# Altium project FLXESC.PrjPcb
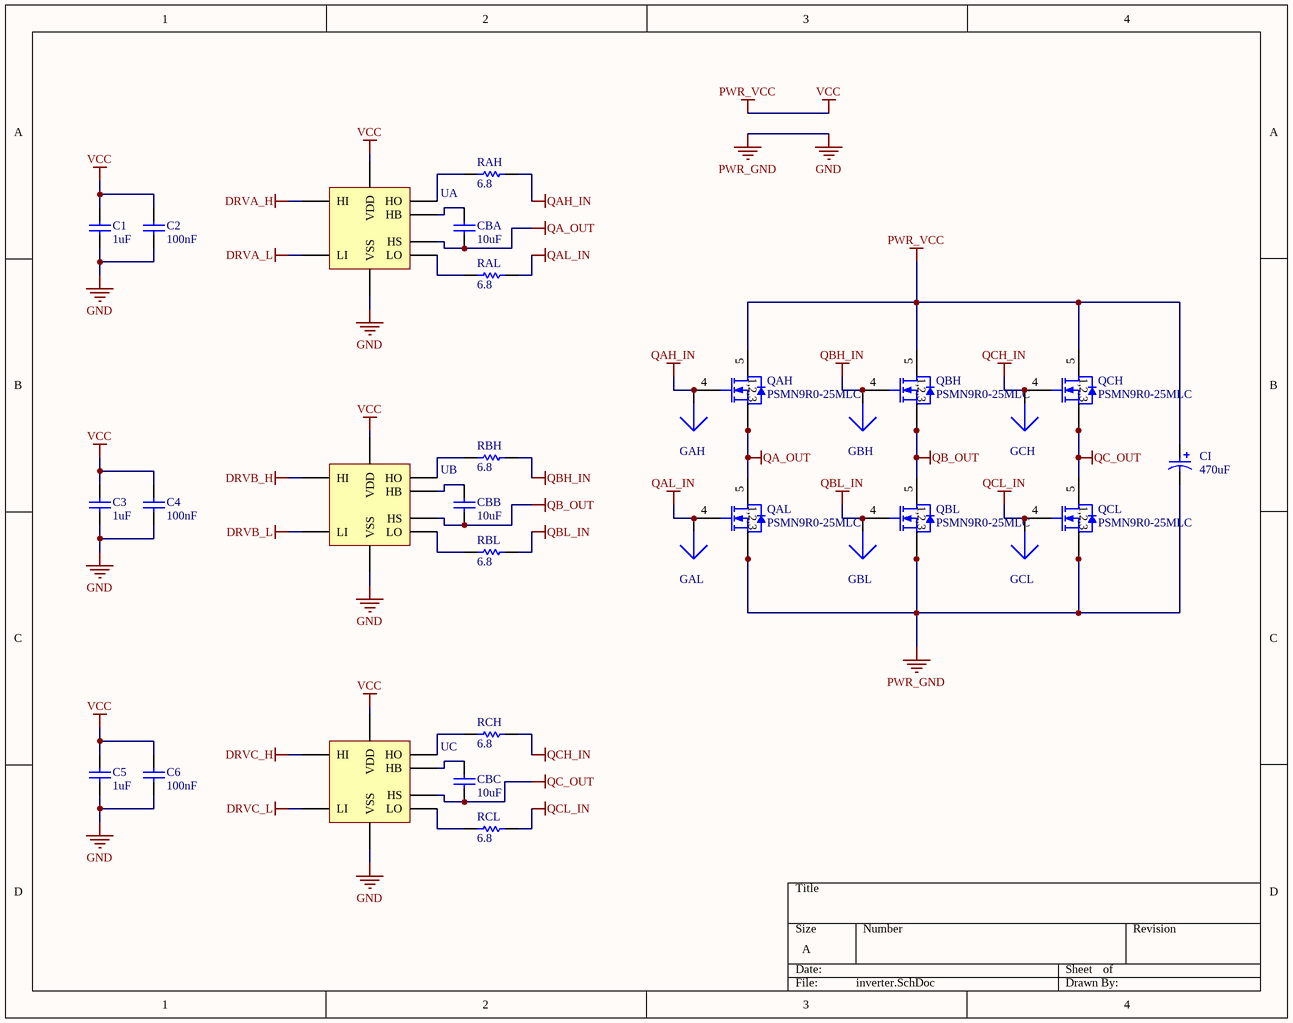
[diagram p0: inverter.SchDoc]
4 sheets, 87 parts. Net scope: global (net labels, ports and power ports of the same name join across sheets).
Board file: ESC.PcbDoc
Sheets:
  inverter.SchDoc
  connectors.SchDoc
  microcontroller.SchDoc
  phase_sense.SchDoc

## Sheet inverter.SchDoc
size A

### Parts
C1  1uF  [CAPC1608L]
C2  100nF  [CAPC1608L]
C3  1uF  [CAPC1608L]
C4  100nF  [CAPC1608L]
C5  1uF  [CAPC1608L]
C6  100nF  [CAPC1608L]
CBA  10uF  [CAPC3216L]
CBB  10uF  [CAPC3216L]
CBC  10uF  [CAPC3216L]
CI  470uF  [CAP_RADIAL-CAN_SMD_M10]
GAH  TESTPOINT-ARROW-BLUE  [TESTP_PAD_.75mm]  (value not drawn)
GAL  TESTPOINT-ARROW-BLUE  [TESTP_PAD_.75mm]  (value not drawn)
GBH  TESTPOINT-ARROW-BLUE  [TESTP_PAD_.75mm]  (value not drawn)
GBL  TESTPOINT-ARROW-BLUE  [TESTP_PAD_.75mm]  (value not drawn)
GCH  TESTPOINT-ARROW-BLUE  [TESTP_PAD_.75mm]  (value not drawn)
GCL  TESTPOINT-ARROW-BLUE  [TESTP_PAD_.75mm]  (value not drawn)
QAH  value PSMN9R0-25MLC  [x-NXP_LFPAK33]
QAL  value PSMN9R0-25MLC  [x-NXP_LFPAK33]
QBH  value PSMN9R0-25MLC  [x-NXP_LFPAK33]
QBL  value PSMN9R0-25MLC  [x-NXP_LFPAK33]
QCH  value PSMN9R0-25MLC  [x-NXP_LFPAK33]
QCL  value PSMN9R0-25MLC  [x-NXP_LFPAK33]
RAH  6.8  [RESC1608L]
RAL  6.8  [RESC1608L]
RBH  6.8  [RESC1608L]
RBL  6.8  [RESC1608L]
RCH  6.8  [RESC1608L]
RCL  6.8  [RESC1608L]
UA  UCC27201A  [x-TI_S-PVSON-N9]  (value not drawn)
UB  UCC27201A  [x-TI_S-PVSON-N9]  (value not drawn)
UC  UCC27201A  [x-TI_S-PVSON-N9]  (value not drawn)

### Nets
DRVA_H: UA.6(HI)
DRVA_L: UA.7(LI)
DRVB_H: UB.6(HI)
DRVB_L: UB.7(LI)
DRVC_H: UC.6(HI)
DRVC_L: UC.7(LI)
GND: C1.2 C2.2 C3.2 C4.2 C5.2 C6.2 CI.2 QAL.1(S) QAL.2(S) QAL.3(S) QBL.1(S) QBL.2(S) QBL.3(S) QCL.1(S) QCL.2(S) QCL.3(S) UA.8(VSS) UB.8(VSS) UC.8(VSS)  [also labelled PWR_GND]
PWR_VCC: C1.1 C2.1 C3.1 C4.1 C5.1 C6.1 CI.1 QAH.5(D) QBH.5(D) QCH.5(D) UA.1(VDD) UB.1(VDD) UC.1(VDD)  [also labelled VCC]
QA_OUT: CBA.2 QAH.1(S) QAH.2(S) QAH.3(S) QAL.5(D) UA.4(HS)
QAH_IN: GAH.1 QAH.4(G) RAH.1
QAL_IN: GAL.1 QAL.4(G) RAL.1
QB_OUT: CBB.2 QBH.1(S) QBH.2(S) QBH.3(S) QBL.5(D) UB.4(HS)
QBH_IN: GBH.1 QBH.4(G) RBH.1
QBL_IN: GBL.1 QBL.4(G) RBL.1
QC_OUT: CBC.2 QCH.1(S) QCH.2(S) QCH.3(S) QCL.5(D) UC.4(HS)
QCH_IN: GCH.1 QCH.4(G) RCH.1
QCL_IN: GCL.1 QCL.4(G) RCL.1
NetCBA_1: CBA.1 UA.2(HB)
NetCBB_1: CBB.1 UB.2(HB)
NetCBC_1: CBC.1 UC.2(HB)
NetRAH_2: RAH.2 UA.3(HO)
NetRAL_2: RAL.2 UA.9(LO)
NetRBH_2: RBH.2 UB.3(HO)
NetRBL_2: RBL.2 UB.9(LO)
NetRCH_2: RCH.2 UC.3(HO)
NetRCL_2: RCL.2 UC.9(LO)

### Notes on the sheet
- (in symbol PSMN9R0-25MLC) 1,2,3

### Library data of the parts
C1 C3 C5 = CAP_1u_0603_25V_X5R_10%: CAP CER 1UF 25V 10% X5R 0603; Manufacturer Part Number: TMK107BJ105KA-T; Name: CAP_1u_0603_25V_X5R_10%; Value: 1uF; Supplier 1: Digi-Key; Supplier Part Number 1: 587-1248-1-ND
C2 C4 C6 = CAP_100n_0603_50V_Y5V: CAP CER 0.1UF 50V Y5V 0603; Manufacturer Part Number: CC0603ZRY5V9BB104; Name: CAP_100n_0603_50V_Y5V; Value: 100nF; Supplier 1: Digi-Key; Supplier Part Number 1: 311-1343-1-ND
CBA CBB CBC = CAP_10u_1206_25V_Y5V: CAP CER 10UF 25V Y5V 1206; Manufacturer Part Number: TMK316F106ZL-T; Name: CAP_10u_1206_25V_Y5V; Value: 10uF; Supplier 1: Digi-Key; Supplier Part Number 1: 587-1353-1-ND
CI = CAP_E_470u_Dia10_25V_Al_20%: CAP ALUM 470UF 25V 20% SMD; Manufacturer: Nichicon; Manufacturer Part Number: UCW1E471MNL1GS; Name: CAP_E_470u_Dia10_25V_Al_20%; Value: 470uF; Supplier 1: Digi-Key; Supplier Part Number 1: 493-9424-1-ND
GAH GAL GBH GBL GCH GCL = TESTP_PAD_.75mm: Round Test Point on Board; Value: 0.75mm; Name: TESTP_PAD_.75mm
QAH QAL QBH QBL QCH QCL = PSMN9R0-25MLC: TRANSISTOR MOSFET N-CHANN 25V 8.6MOHM; Manufacturer: NXP Semiconductors; Manufacturer Part Number: PSMN9R0-25MLC,115; Name: PSMN9R0-25MLC; Supplier 1: Digi-Key; Supplier Part Number 1: 568-9578-1-ND
RAH RAL RBH RBL RCH RCL = RES_6R8_0603_0W1_1%: RES 6.8 OHM 1/10W 1% 0603; Manufacturer: Stackpole Electronics Inc; Manufacturer Part Number: RMCF0603FT6R80; Name: RES_6R8_0603_0W1_1%; Value: 6.8; Supplier 1: Digi-Key; Supplier Part Number 1: RMCF0603FT6R80CT-ND
UA UB UC = x-TI_UCC27201A: IC DVR HIGH/LOW SIDE 3A 9SON; Manufacturer: Texas Instruments; Manufacturer Part Number: UCC27201ADRCT; Name: x-TI_UCC27201A; Supplier 1: Digi-Key; Supplier Part Number 1: 296-30051-2-ND

## Sheet connectors.SchDoc
size A
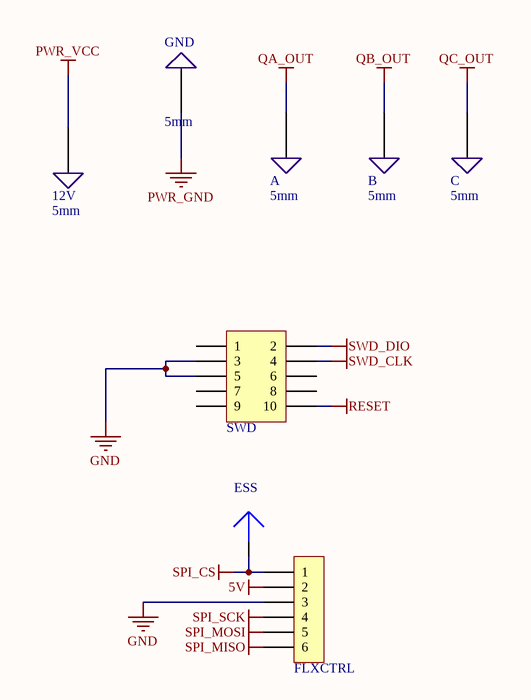
[diagram p1: connectors.SchDoc]

### Parts
12V  5mm  [SQUARE_PAD_5mm]  (no BOM)
A  5mm  [SQUARE_PAD_5mm]  (no BOM)
B  5mm  [SQUARE_PAD_5mm]  (no BOM)
C  5mm  [SQUARE_PAD_5mm]  (no BOM)
ESS  TESTPOINT-ARROW-BLUE  [TESTP_PAD_.75mm]  (value not drawn)
FLXCTRL  HEADER-6x1  [X-JST-S6B-ZR]  (value not drawn)
GND  5mm  [SQUARE_PAD_5mm]  (no BOM)
SWD  HEADER-5x2S  [G-HEADER_5x2I.05P_SM]  (value not drawn)

### Nets
5V: FLXCTRL.2
GND: FLXCTRL.3 GND.1(Wire) SWD.3 SWD.5  [also labelled PWR_GND]
PWR_VCC: 12V.1(Wire)
QA_OUT: A.1(Wire)
QB_OUT: B.1(Wire)
QC_OUT: C.1(Wire)
RESET: SWD.10
SPI_CS: ESS.1 FLXCTRL.1
SPI_MISO: FLXCTRL.6
SPI_MOSI: FLXCTRL.5
SPI_SCK: FLXCTRL.4
SWD_CLK: SWD.4
SWD_DIO: SWD.2

Not connected (* = marked no-connect by the designer): SWD 1 6 7 8 9

### Library data of the parts
12V A B C GND = SOLDER_WIRE_5x5: Pad to solder wire; Name: SOLDER_WIRE_5x5; Value: 5mm
ESS = TESTP_PAD_.75mm: Round Test Point on Board; Value: 0.75mm; Name: TESTP_PAD_.75mm
FLXCTRL = HEADER_6x1_1.5mm_ZH_TH: CONN HEADER ZH SIDE 6POS 1.5MM; Manufacturer: JST Sales America Inc; Manufacturer Part Number: S6B-ZR(LF)(SN); Name: HEADER_6x1_1.5mm_ZH_TH; Supplier 1: Digi-Key; Supplier Part Number 1: 455-1673-ND
SWD = HEADER_5x2_50mil_U: CONN HEADER 10POS DL UNSHRD SMD; Name: HEADER_5x2_50mil_U

## Sheet microcontroller.SchDoc
size A
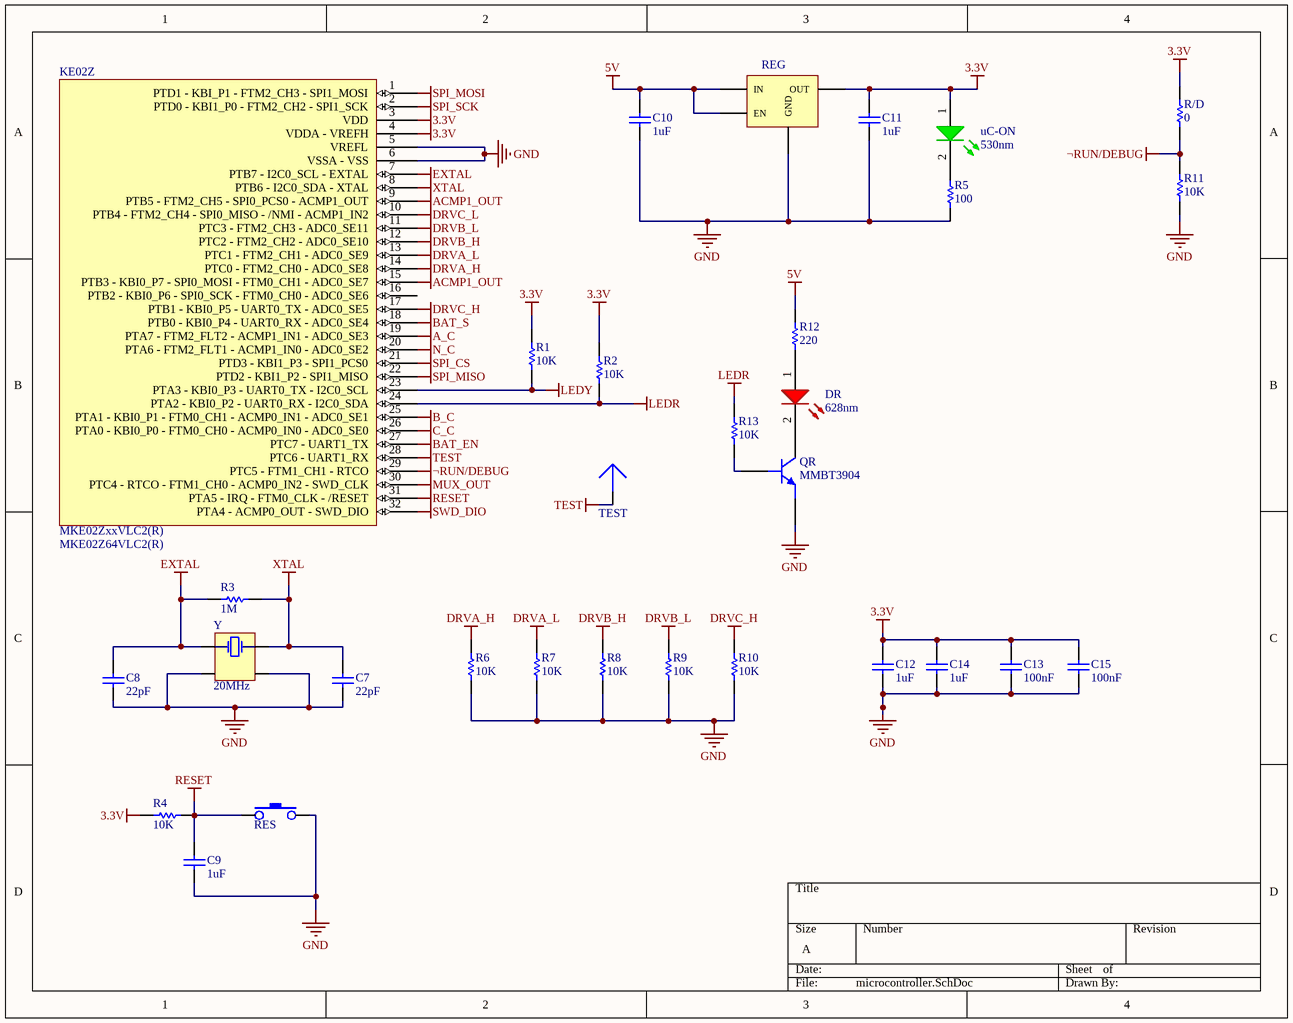
[diagram p2: microcontroller.SchDoc]

### Parts
C7  22pF  [CAPC1608L]
C8  22pF  [CAPC1608L]
C9  1uF  [CAPC1608L]
C10  1uF  [CAPC1608L]
C11  1uF  [CAPC1608L]
C12  1uF  [CAPC1608L]
C13  100nF  [CAPC1608L]
C14  1uF  [CAPC1608L]
C15  100nF  [CAPC1608L]
DR  value 628nm  [DSO-F2/D3.4]  (hidden comment: LED-RED)
KE02Z  MKE02ZxxVLC2(R)  Manufacturer Part Number: MKE02Z64VLC2(R)  [JEDEC_MS-026BBA]
QR  value MMBT3904  [SOT23-3L]  (hidden comment: BJT-NPN-BEC)
R1  10K  [RESC1608L]
R2  10K  [RESC1608L]
R3  1M  [RESC1608L]
R4  10K  [RESC1608L]
R5  100  [RESC1608L]
R6  10K  [RESC1608L]
R7  10K  [RESC1608L]
R8  10K  [RESC1608L]
R9  10K  [RESC1608L]
R10  10K  [RESC1608L]
R11  10K  [RESC1608L]
R12  220  [RESC1608L]
R13  10K  [RESC1608L]
R/D  0  [RESC1608L]
REG  LP5900  [x-TI_S-NGF0006A]  (value not drawn)
RES  SWITCH_TACTILE_SPST-2T-NO  [X-TECO_FSMSM]  (value not drawn)
TEST  TESTPOINT-ARROW-BLUE  [TESTP_PAD_.75mm]  (value not drawn)
uC-ON  value 530nm  [DSO-F2/D3.4]  (hidden comment: LED-GREEN)
Y  20MHz  [X-EPSO_TSX-3225]

### Nets
3.3V: C11.1 C12.1 C13.1 C14.1 C15.1 KE02Z.3(VDD) KE02Z.4(VDDA_-_VREFH) R1.1 R2.1 R4.1 R/D.1 REG.1(OUT) uC-ON.1(A)
5V: C10.1 R12.1 REG.4(EN) REG.6(IN)
A_C: KE02Z.19(PTA7_-_FTM2_FLT2_-_ACMP1_IN1_-_ADC0_SE3)
ACMP1_OUT: KE02Z.9(PTB5_-_FTM2_CH5_-_SPI0_PCS0_-_ACMP1_OUT) KE02Z.15(PTB3_-_KBI0_P7_-_SPI0_MOSI_-_FTM0_CH1_-_ADC0_SE7)
B_C: KE02Z.25(PTA1_-_KBI0_P1_-_FTM0_CH1_-_ACMP0_IN1_-_ADC0_SE1)
BAT_EN: KE02Z.27(PTC7_-_UART1_TX)
BAT_S: KE02Z.18(PTB0_-_KBI0_P4_-_UART0_RX_-_ADC0_SE4)
C_C: KE02Z.26(PTA0_-_KBI0_P0_-_FTM0_CH0_-_ACMP0_IN0_-_ADC0_SE0)
DRVA_H: KE02Z.14(PTC0_-_FTM2_CH0_-_ADC0_SE8) R6.1
DRVA_L: KE02Z.13(PTC1_-_FTM2_CH1_-_ADC0_SE9) R7.1
DRVB_H: KE02Z.12(PTC2_-_FTM2_CH2_-_ADC0_SE10) R8.1
DRVB_L: KE02Z.11(PTC3_-_FTM2_CH3_-_ADC0_SE11) R9.1
DRVC_H: KE02Z.17(PTB1_-_KBI0_P5_-_UART0_TX_-_ADC0_SE5) R10.1
DRVC_L: KE02Z.10(PTB4_-_FTM2_CH4_-_SPI0_MISO_-_/NMI_-_ACMP1_IN2)
EXTAL: C8.1 KE02Z.7(PTB7_-_I2C0_SCL_-_EXTAL) R3.2 Y.1
GND: C7.2 C8.2 C9.2 C10.2 C11.2 C12.2 C13.2 C14.2 C15.2 KE02Z.5(VREFL) KE02Z.6(VSSA_-_VSS) QR.2(E) R5.2 R6.2 R7.2 R8.2 R9.2 R10.2 R11.2 REG.3(GND) RES.2 Y.2 Y.4
LEDR: KE02Z.24(PTA2_-_KBI0_P2_-_UART0_RX_-_I2C0_SDA) R2.2 R13.2
LEDY: KE02Z.23(PTA3_-_KBI0_P3_-_UART0_TX_-_I2C0_SCL) R1.2
MUX_OUT: KE02Z.30(PTC4_-_RTCO_-_FTM1_CH0_-_ACMP0_IN2_-_SWD_CLK)
N_C: KE02Z.20(PTA6_-_FTM2_FLT1_-_ACMP1_IN0_-_ADC0_SE2)
RESET: C9.1 KE02Z.31(PTA5_-_IRQ_-_FTM0_CLK_-_/RESET) R4.2 RES.1
SPI_CS: KE02Z.21(PTD3_-_KBI1_P3_-_SPI1_PCS0)
SPI_MISO: KE02Z.22(PTD2_-_KBI1_P2_-_SPI1_MISO)
SPI_MOSI: KE02Z.1(PTD1_-_KBI_P1_-_FTM2_CH3_-_SPI1_MOSI)
SPI_SCK: KE02Z.2(PTD0_-_KBI1_P0_-_FTM2_CH2_-_SPI1_SCK)
SWD_DIO: KE02Z.32(PTA4_-_ACMP0_OUT_-_SWD_DIO)
TEST: KE02Z.28(PTC6_-_UART1_RX) TEST.1
XTAL: C7.1 KE02Z.8(PTB6_-_I2C0_SDA_-_XTAL) R3.1 Y.3
¬RUN/DEBUG: KE02Z.29(PTC5_-_FTM1_CH1_-_RTCO) R11.1 R/D.2
NetDR_1: DR.1(A) R12.2
NetDR_2: DR.2(K) QR.3(C)
NetQR_1: QR.1(B) R13.1
NetR5_1: R5.1 uC-ON.2(K)

Not connected (* = marked no-connect by the designer): KE02Z 16(PTB2_-_KBI0_P6_-_SPI0_SCK_-_FTM0_CH0_-_ADC0_SE6)

### Library data of the parts
C7 C8 = CAP_22p_0603_50V_NP0_5%: CAP CER 22PF 50V 5% NP0 0603; Manufacturer Part Number: CL10C220JB8NCNC; Name: CAP_22p_0603_50V_NP0_5%; Value: 22pF; Supplier 1: Digi-Key; Supplier Part Number 1: 1276-2227-1-ND
C9-C12 C14 = CAP_1u_0603_25V_X5R_10%: as C1 on sheet inverter; Name: CAP_1u_0603_25V_X5R_10%; Value: 1uF; Supplier 1: Digi-Key; Supplier Part Number 1: 587-1248-1-ND
C13 C15 = CAP_100n_0603_50V_Y5V: as C2 on sheet inverter; Name: CAP_100n_0603_50V_Y5V; Value: 100nF; Supplier 1: Digi-Key; Supplier Part Number 1: 311-1343-1-ND
DR = LED_RED_0603_628: LED POINTLED 628NM SUPER RED SMD; Manufacturer: OSRAM Opto Semiconductors Inc; Manufacturer Part Number: LS Q971-KN-1; Drawn By: Juan I Carrano; Name: LED_RED_0603_628; Supplier 1: Digi-Key; Supplier Part Number 1: 475-3016-1-ND
KE02Z = MKE02Z64VLC2(R): Kinetis KE02 Cortex®-M0+ MCU 32 Pin LQFP; Manufacturer: Freescale; Name: MKE02Z64VLC2(R)
QR = MMBT3904: TRANSISTOR NPN 40V 0.2A SOT23; Manufacturer: NXP Semiconductors; Name: MMBT3904; Manufacturer Part Number: MMBT3904; Supplier 1: Digi-Key; Supplier Part Number 1: 568-4510-1-ND
R1 R2 R4 R6-R11 R13 = RES_10K_0603_0W1_1%: RES 10K OHM 1/10W 5% 0603; Manufacturer Part Number: RC1608J103CS; Name: RES_10K_0603_0W1_1%; Value: 10K; Supplier 1: Digi-Key; Supplier Part Number 1: 1276-5086-1-ND
R3 = RES_1M_0603_0W1_1%: RES 1.00M OHM 1/10W 1% 0603 SMD; Manufacturer: Yageo; Manufacturer Part Number: RC0603FR-071ML; Name: RES_1M_0603_0W1_1%; Value: 1M; Supplier 1: Digi-Key; Supplier Part Number 1: 311-1.00MHRCT-ND
R5 = RES_100_0603_0W1_1%: RES 100 OHM 1/10W 5% 0603 SMD; Manufacturer Part Number: RC0603JR-07100RL; Name: RES_100_0603_0W1_1%; Value: 100; Supplier 1: Digi-Key; Supplier Part Number 1: 311-100GRCT-ND
R12 = RES_100_0603_0W1_1%: RES 100 OHM 1/10W 5% 0603 SMD; Manufacturer Part Number: RC0603JR-07100RL; Value: 100; Name: RES_100_0603_0W1_1%; Supplier 1: Digi-Key; Supplier Part Number 1: 311-100GRCT-ND
R/D = RES_0_0603_0W1_1%: RES 0.0 OHM 1/10W JUMP 0603; Manufacturer Part Number: RC1608J000CS; Name: RES_0_0603_0W1_1%; Value: 0; Supplier 1: Digi-Key; Supplier Part Number 1: 1276-3510-1-ND
REG = x-TI_LP5900: IC REG LDO 3.3V 0.15A 6WSON; Manufacturer: Texas Instruments; Manufacturer Part Number: LP5900SD-3.3/NOPB; Name: x-TI_LP5900; Supplier 1: Digi-Key; Supplier Part Number 1: LP5900SD-3.3/NOPBCT-ND
RES = SW_TACT_3.5x6mm_SMT: SWITCH TACTILE SPST-NO 0.05A 12V; Manufacturer: TE Connectivity; Manufacturer Part Number: FSMSM; Name: SW_TACT_3.5x6mm_SMT; Supplier 1: Digi-Key; Supplier Part Number 1: 450-1140-ND
TEST = TESTP_PAD_.75mm: Round Test Point on Board; Value: 0.75mm; Name: TESTP_PAD_.75mm
uC-ON = LED_GREEN_0603_530: LED CHIPLED 570NM GREEN 0603 SMD; Manufacturer: OSRAM Opto Semiconductors Inc; Manufacturer Part Number: LG Q971-KN-1; Drawn By: Juan I Carrano; Name: LED_GREEN_0603_530; Supplier 1: Digi-Key; Supplier Part Number 1: 475-1409-1-ND
Y = XTAL_20M_SMD_9p: CRYSTAL 20MHZ 9PF SMD; Manufacturer: EPSON; Manufacturer Part Number: TSX-3225 20.0000MF20G-AC3; Drawn By: Juan I Carrano; Name: XTAL_20M_SMD_9p; Value: 20MHz; Supplier 1: Digi-Key; Supplier Part Number 1: SER3629CT-ND

## Sheet phase_sense.SchDoc
size A
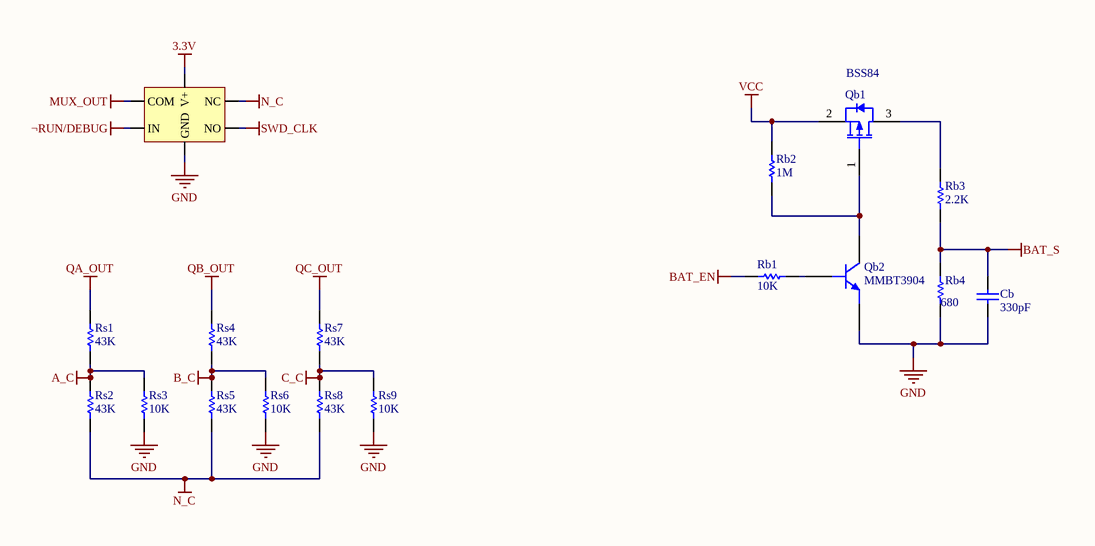
[diagram p3: phase_sense.SchDoc]

### Parts
Cb  330pF  [CAPC2012L]
MUX  TS5A3159A  [JEDEC_MO-178AB]  (value not drawn)
Qb1  BSS84  [SOT23-3L]
Qb2  value MMBT3904  [SOT23-3L]  (hidden comment: BJT-NPN-BEC)
Rb1  10K  [RESC1608L]
Rb2  1M  [RESC1608L]
Rb3  2.2K  [RESC1608L]
Rb4  680  [RESC1608L]
Rs1  43K  [RESC1608L]
Rs2  43K  [RESC1608L]
Rs3  10K  [RESC1608L]
Rs4  43K  [RESC1608L]
Rs5  43K  [RESC1608L]
Rs6  10K  [RESC1608L]
Rs7  43K  [RESC1608L]
Rs8  43K  [RESC1608L]
Rs9  10K  [RESC1608L]

### Nets
3.3V: MUX.5(V+)
A_C: Rs1.2 Rs2.1 Rs3.1
B_C: Rs4.2 Rs5.1 Rs6.1
BAT_EN: Rb1.2
BAT_S: Cb.1 Rb3.2 Rb4.1
C_C: Rs7.2 Rs8.1 Rs9.1
GND: Cb.2 MUX.2(GND) Qb2.2(E) Rb4.2 Rs3.2 Rs6.2 Rs9.2
MUX_OUT: MUX.4(COM)
N_C: MUX.3(NC) Rs2.2 Rs5.2 Rs8.2
QA_OUT: Rs1.1
QB_OUT: Rs4.1
QC_OUT: Rs7.1
SWD_CLK: MUX.1(NO)
VCC: Qb1.2(S) Rb2.1  [project net PWR_VCC]
¬RUN/DEBUG: MUX.6(IN)
NetQb1_1: Qb1.1(G) Qb2.3(C) Rb2.2
NetQb1_3: Qb1.3(D) Rb3.1
NetQb2_1: Qb2.1(B) Rb1.1

### Library data of the parts
Cb = CAP_330p_0805_100V_NP0_10%: CAP CER 330PF 100V 5% NP0 0805; Manufacturer Part Number: CL21C331JCANNNC; Name: CAP_330p_0805_100V_NP0_10%; Value: 330pF; Supplier 1: Digi-Key; Supplier Part Number 1: 1276-2646-1-ND
MUX = x-TI_TS5A3159A: IC SWITCH SPDT SOT23-6; Manufacturer: "Texas Instruments"; Manufacturer Part Number: TS5A3159ADBVR; Name: x-TI_TS5A3159A; Supplier 1: Digi-Key; Supplier Part Number 1: 296-19265-1-ND
Qb1 = BSS84: MOSFET P-CH 50V 130MA SOT-23; Manufacturer: Fairchild Semiconductor; Name: BSS84; Value: BSS84; Manufacturer Part Number: BSS84; Supplier 1: Digi-Key; Supplier Part Number 1: BSS84CT-ND
Qb2 = MMBT3904: as QR on sheet microcontroller; Name: MMBT3904; Manufacturer Part Number: MMBT3904; Supplier 1: Digi-Key; Supplier Part Number 1: 568-4510-1-ND
Rb1 Rs1-Rs9 = RES_10K_0603_0W1_1%: as R1 on sheet microcontroller; Name: RES_10K_0603_0W1_1%; Value: 10K; Supplier 1: Digi-Key; Supplier Part Number 1: 1276-5086-1-ND
Rb2 = RES_1M_0603_0W1_1%: as R3 on sheet microcontroller; Name: RES_1M_0603_0W1_1%; Value: 1M; Supplier 1: Digi-Key; Supplier Part Number 1: 311-1.00MHRCT-ND
Rb3 = RES_2K2_0603_0W1_1%: RES 2.2K OHM 1/10W 1% 0603 SMD; Manufacturer: Rohm Semiconductor; Manufacturer Part Number: MCR03ERTF2201; Name: RES_2K2_0603_0W1_1%; Value: 2.2K; Supplier 1: Digi-Key; Supplier Part Number 1: RHM2.20KCFCT-ND
Rb4 = RES_680_0603_0W1_1%: RES 680 OHM 1/10W 1% 0603 SMD; Manufacturer: Rohm Semiconductor; Manufacturer Part Number: MCR03ERTF6800; Name: RES_680_0603_0W1_1%; Value: 680; Supplier 1: Digi-Key; Supplier Part Number 1: RHM680CFCT-ND

## Nets that join several sheets
3.3V: microcontroller (13 pins), phase_sense (MUX.5)
5V: connectors (FLXCTRL.2), microcontroller (C10.1 R12.1 REG.4 REG.6)
A_C: microcontroller (KE02Z.19), phase_sense (Rs1.2 Rs2.1 Rs3.1)
B_C: microcontroller (KE02Z.25), phase_sense (Rs4.2 Rs5.1 Rs6.1)
BAT_EN: microcontroller (KE02Z.27), phase_sense (Rb1.2)
BAT_S: microcontroller (KE02Z.18), phase_sense (Cb.1 Rb3.2 Rb4.1)
C_C: microcontroller (KE02Z.26), phase_sense (Rs7.2 Rs8.1 Rs9.1)
DRVA_H: inverter (UA.6), microcontroller (KE02Z.14 R6.1)
DRVA_L: inverter (UA.7), microcontroller (KE02Z.13 R7.1)
DRVB_H: inverter (UB.6), microcontroller (KE02Z.12 R8.1)
DRVB_L: inverter (UB.7), microcontroller (KE02Z.11 R9.1)
DRVC_H: inverter (UC.6), microcontroller (KE02Z.17 R10.1)
DRVC_L: inverter (UC.7), microcontroller (KE02Z.10)
GND: inverter (19 pins), connectors (FLXCTRL.3 GND.1 SWD.3 SWD.5), microcontroller (23 pins), phase_sense (7 pins)
MUX_OUT: microcontroller (KE02Z.30), phase_sense (MUX.4)
N_C: microcontroller (KE02Z.20), phase_sense (MUX.3 Rs2.2 Rs5.2 Rs8.2)
PWR_VCC: inverter (13 pins), connectors (12V.1), phase_sense (Qb1.2 Rb2.1)
QA_OUT: inverter (6 pins), connectors (A.1), phase_sense (Rs1.1)
QB_OUT: inverter (6 pins), connectors (B.1), phase_sense (Rs4.1)
QC_OUT: inverter (6 pins), connectors (C.1), phase_sense (Rs7.1)
RESET: connectors (SWD.10), microcontroller (C9.1 KE02Z.31 R4.2 RES.1)
SPI_CS: connectors (ESS.1 FLXCTRL.1), microcontroller (KE02Z.21)
SPI_MISO: connectors (FLXCTRL.6), microcontroller (KE02Z.22)
SPI_MOSI: connectors (FLXCTRL.5), microcontroller (KE02Z.1)
SPI_SCK: connectors (FLXCTRL.4), microcontroller (KE02Z.2)
SWD_CLK: connectors (SWD.4), phase_sense (MUX.1)
SWD_DIO: connectors (SWD.2), microcontroller (KE02Z.32)
¬RUN/DEBUG: microcontroller (KE02Z.29 R11.1 R/D.2), phase_sense (MUX.6)